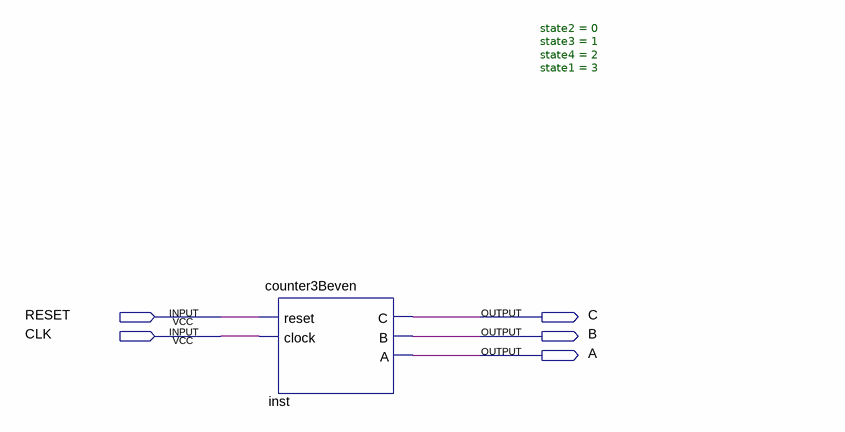
[diagram p0: schematic sheet]
// Quartus schematic TB1.bdf as structural Verilog: 1 symbols, 5 pins
module TB1 (
  input  RESET,
  input  CLK,
  output C,
  output B,
  output A
);

  counter3Beven #(.state2(0), .state3(1), .state4(2), .state1(3)) inst (
    .reset(RESET), .clock(CLK), .C(C), .B(B), .A(A));
endmodule
